# EAGLE design Arduino BNO080 (EAGLE 9.5.0)
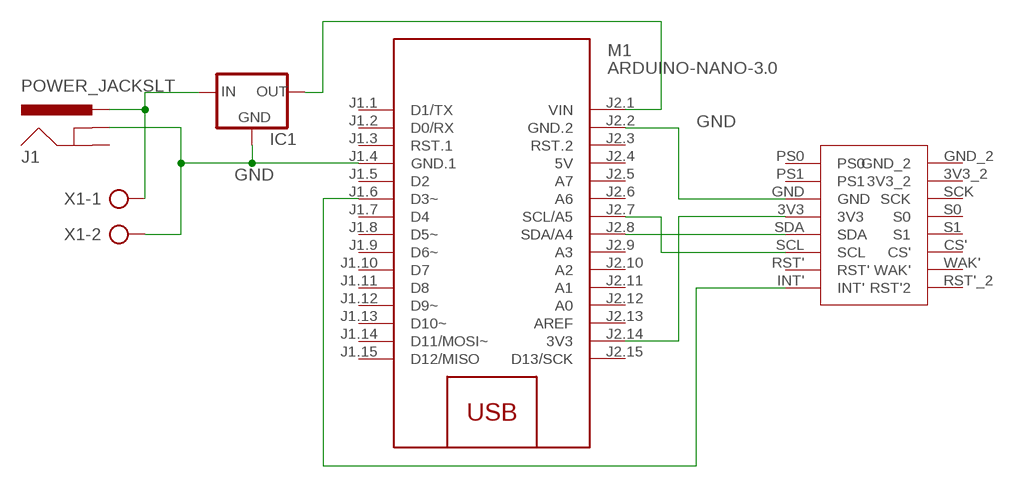
[diagram p0: schematic, sheet 1]

## Parts
IC1  78XXS  [78XXS]
J1  POWER_JACKSLT  [POWER_JACK_SLOT]
M1  ARDUINO-NANO-3.0  [ARDUINO-NANO-3.0]
U$1  BNO080  [BNO080]
X1  AK300/2  [AK300/2]

## Nets
GND: IC1.GND J1.GND@1(GNDBREAK) M1.J1.4(GND.1) M1.J2.2(GND.2) U$1.GND X1.2
N$1: M1.J2.8(SDA/A4) U$1.SDA
N$2: M1.J2.7(SCL/A5) U$1.SCL
N$3: M1.J2.14(3V3) U$1.3V3
N$5: M1.J1.6(D3~) U$1.INT'
N$7: IC1.IN J1.PWR X1.1
N$8: IC1.OUT M1.J2.1(VIN)
Unconnected: J1.GND@2(GND) M1.J1.1(D1/TX) M1.J1.2(D0/RX) M1.J1.3(RST.1) M1.J1.5(D2) M1.J1.7(D4) M1.J1.8(D5~) M1.J1.9(D6~) M1.J1.10(D7) M1.J1.11(D8) M1.J1.12(D9~) M1.J1.13(D10~) M1.J1.14(D11/MOSI~) M1.J1.15(D12/MISO) M1.J2.3(RST.2) M1.J2.5(A7) M1.J2.6(A6) M1.J2.9(A3) M1.J2.10(A2) M1.J2.11(A1) M1.J2.12(A0) M1.J2.13(AREF) M1.J2.15(D13/SCK) U$1.3V3_2 U$1.CS' U$1.GND_2 U$1.PS0 U$1.PS1 U$1.RST' U$1.RST'_2(RST'2) U$1.S0 U$1.S1 U$1.SCK U$1.WAK'

## Power pins joined to a net without a drawn wire
5V: M1.J2.4(5V)

## Library data of the parts
IC1 = v-reg:78XXS: VOLTAGE REGULATOR
J1 = SparkFun-Connectors:POWER_JACK: Power Jack Connector This is the standard 5.5mm barrel jack for power. The PTH is the most common, proven, reliable, footprint. The Slot footprint only works if the mill layer is transmitted to the PCB fab house so be warned. Here are the connectors we sell at SparkFun: DC Barrel Power Jack/Connector <https://www.sparkfun.com/products/119> (PRT-00119) DC Barrel Power Jack/Connector (SMD) <https://www.sparkfun.com/products/12748> (PRT-12748) DC Barrel Jack Adapter - Breadboard Compatible <https://www.sparkfun.com/products/10811> (PRT-10811) It is used on this SparkFun product (and many, many others): SparkFun RedBoard - Programmed with Arduino <https://www.sparkfun.com/products/12757> (DEV-12757) Also, if you need a mating power supply or connector, please check these out: Wall Adapter Power Supply - 9VDC 650mA <https://www.sparkfun.com/products/298> (TOL-00298) DC Barrel Jack Adapter - Male <https://www.sparkfun.com/products/10287> (PRT-10287); PROD_ID: PRT-00119
M1 = diy-modules:ARDUINO-NANO-3.0: Arduino Nano 3.0 and compatible devices More details available here: https://www.arduino.cc/en/Main/ArduinoBoardNano Click here to find device on ebay.com <http://www.ebay.com/sch/arduino+nano>
U$1 = BNO080:BNO080
X1 = con-ptr500:AK300/2: CONNECTOR; OC_FARNELL: unknown; OC_NEWARK: unknown

## Board
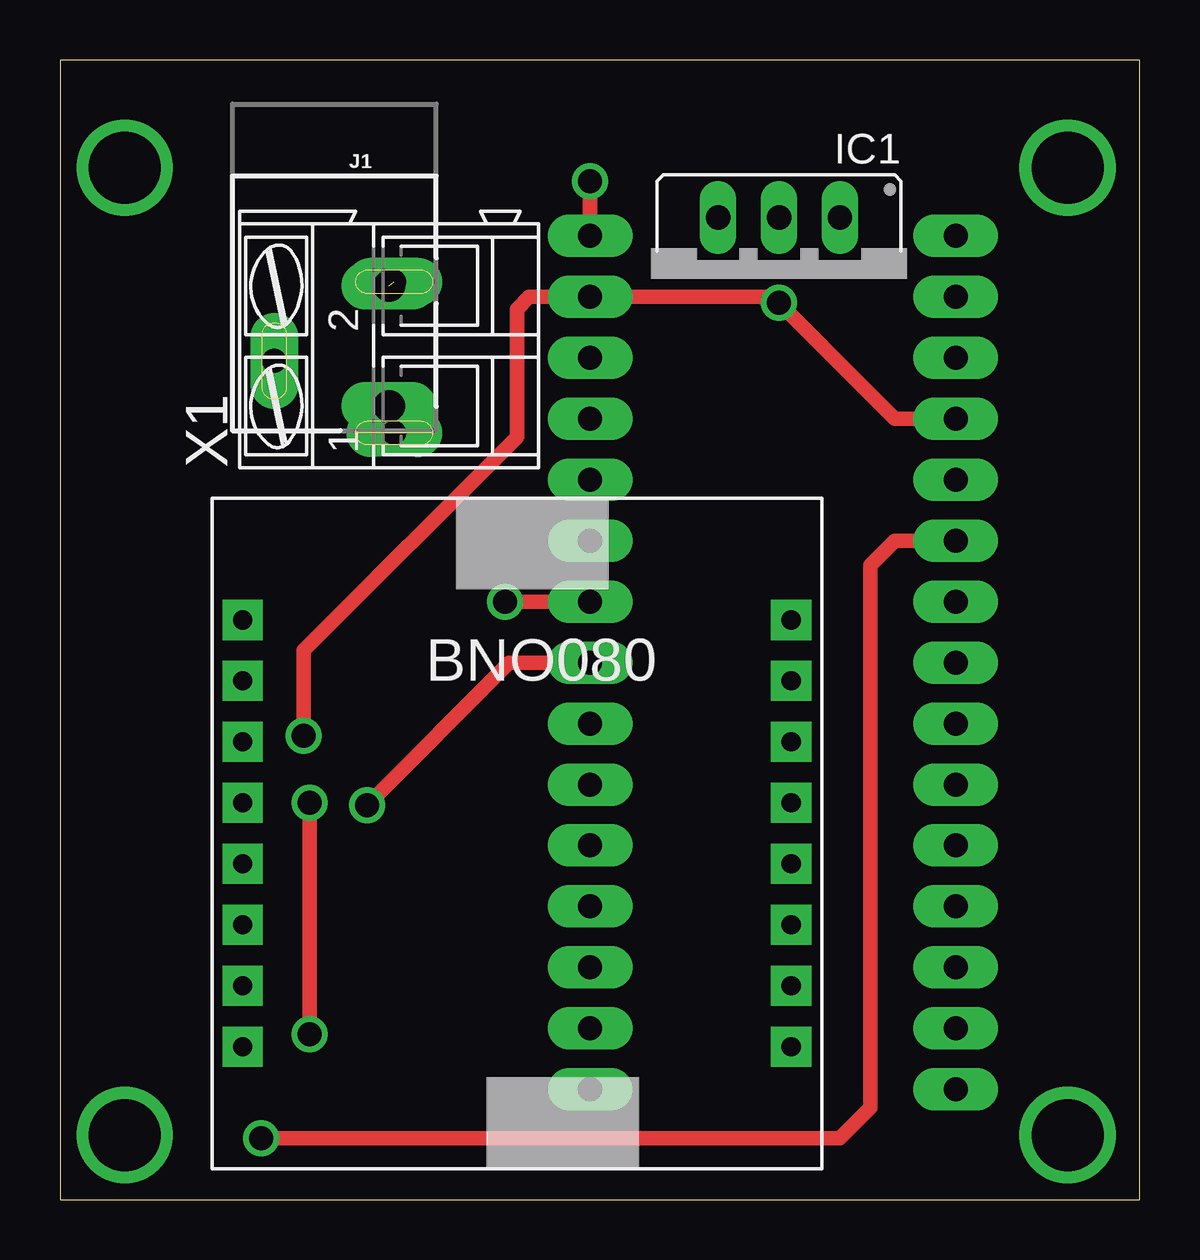
[diagram p1: board, top side]
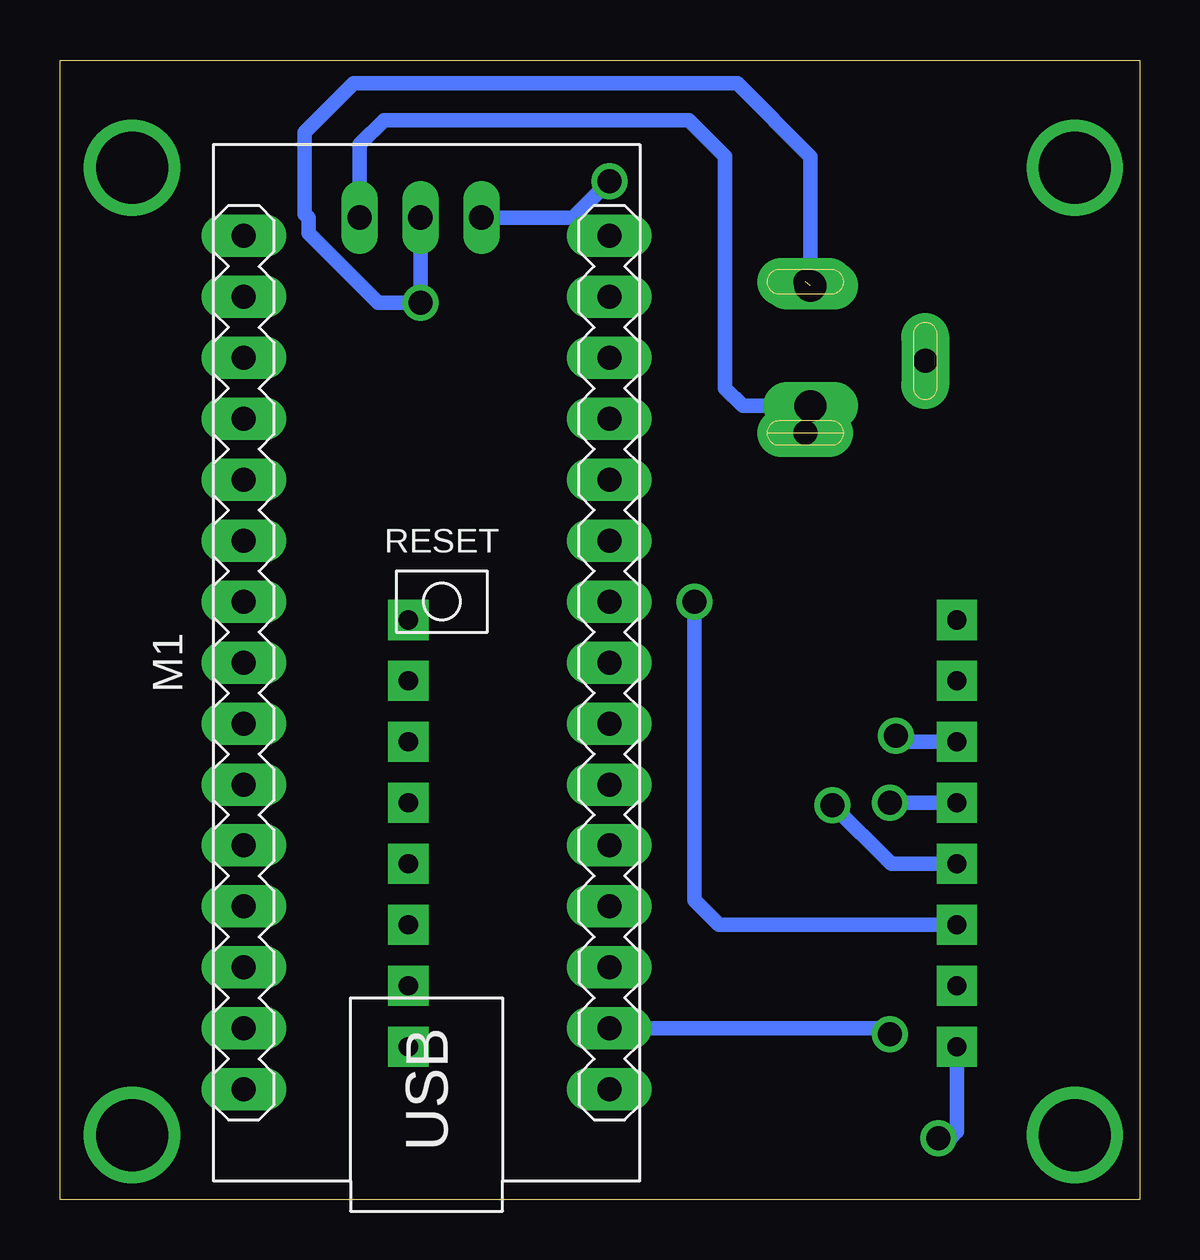
[diagram p2: board, bottom side, seen from below]

Size 45 x 47.49 mm. Coordinates in mm from the lower left corner, seen from the top.
Outline: 0,0 45,0 45,47.49 0,47.49 0,0
Copper layers (1*16): Top 0.035mm / dielectric 1.5mm / Bottom 0.035mm
Design rules "default": minimum track width 6mil, minimum drill 0.35mm, track to track 24mil, track to pad 24mil, pad to pad 24mil, via to via 24mil, smd to smd 24mil, copper to edge 40mil, drill to drill 6mil, minimum pad ring 10mil, minimum via ring 8mil, stop-mask expansion 4mil, vias tented up to drill 0mil, thermal gap 10mil

### Footprints (pad centres in the part's own frame; a part is rotated, then mirrored left to right if it is on the bottom)
78XXS = drill 1.016 long: GND 0,-2.54; IN -2.54,-2.54; OUT 2.54,-2.54
POWER_JACK_SLOT = drill 1 pad 2 long: GND@1 2.58,7.5; GND@2 7.58,10.8; PWR 2.58,13.8
ARDUINO-NANO-3.0 = drill 1 pad 1.778 long: J1.1 17.78,7.62; J1.2 15.24,7.62; J1.3 12.7,7.62; J1.4 10.16,7.62; J1.5 7.62,7.62; J1.6 5.08,7.62; J1.7 2.54,7.62; J1.8 0,7.62; J1.9 -2.54,7.62; J1.10 -5.08,7.62; J1.11 -7.62,7.62; J1.12 -10.16,7.62; J1.13 -12.7,7.62; J1.14 -15.24,7.62; J1.15 -17.78,7.62; J2.1 17.78,-7.62; J2.2 15.24,-7.62; J2.3 12.7,-7.62; J2.4 10.16,-7.62; J2.5 7.62,-7.62; J2.6 5.08,-7.62; J2.7 2.54,-7.62; J2.8 0,-7.62; J2.9 -2.54,-7.62; J2.10 -5.08,-7.62; J2.11 -7.62,-7.62; J2.12 -10.16,-7.62; J2.13 -12.7,-7.62; J2.14 -15.24,-7.62; J2.15 -17.78,-7.62
BNO080 = drill 0.8 pad 1.676 square: 3V3 -10.16,-6.35; 3V3_2 12.7,-1.27; CS' 12.7,-11.43; GND -10.16,-3.81; GND_2 12.7,1.27; INT' -10.16,-16.51; PS0 -10.16,1.27; PS1 -10.16,-1.27; RST' -10.16,-13.97; RST'_2 12.7,-16.51; S0 12.7,-6.35; S1 12.7,-8.89; SCK 12.7,-3.81; SCL -10.16,-11.43; SDA -10.16,-8.89; WAK' 12.7,-13.97
AK300/2 = drill 1.321 long: 1 -2.515,0; 2 2.489,0

### Placement (x,y rotation side)
IC1  29.97,38.39 180 top
J1  16.51,45.75 180 top
M1  29.72,22.38 90 bottom
U$1  17.78,22.89 0 top
X1  13.72,35.59 90 top

### Tracks (layer width: path | path; a pad name or v marks a point on that pad's centre or on a via)
GND  (via drill 1)  (1 unrouted)
  Top 0.61: v10.16,19.34 10.16,22.89 19.05,31.78 19.05,37.12 19.56,37.62 M1.J2.2 29.72,37.62 v29.97,37.37 34.8,32.54 M1.J1.4
  Bottom 0.61: v10.16,19.34 9.91,19.08 U$1.GND | IC1.GND v29.97,37.37 31.75,37.37 34.65,40.27 34.65,40.91 34.8,41.06 34.8,44.48 32.77,46.51 16.76,46.51 13.72,43.47 X1.2
N$1  (via drill 1)
  Top 0.61: M1.J2.8 18.73,22.38 v12.79,16.45
  Bottom 0.61: v12.79,16.45 10.35,14 U$1.SDA
N$2  (via drill 1)
  Top 0.61: M1.J2.7 v18.54,24.92
  Bottom 0.61: v18.54,24.92 18.54,12.48 17.53,11.46 U$1.SCL
N$3  (via drill 1)
  Top 0.61: v10.41,6.89 v10.41,16.54
  Bottom 0.61: M1.J2.14 10.67,7.14 v10.41,6.89 | v10.41,16.54 U$1.3V3
N$4  (via drill 3 pad 3.1)
  other vias: 2.7,43
N$5  (via drill 1)
  Top 0.61: M1.J1.6 34.8,27.46 33.78,26.45 33.78,3.84 32.51,2.57 v8.38,2.57
  Bottom 0.61: U$1.INT' 7.62,2.83 7.87,2.57 v8.38,2.57
N$6  (via drill 3 pad 3.1)
  other vias: 42,43
N$7
  Bottom 0.61: IC1.IN 32.51,43.97 31.5,44.99 18.78,44.99 17.27,43.48 17.27,33.81 16.54,33.08 X1.1 13.93,32.86 J1.PWR
N$8  (via drill 1)
  Top 0.61: M1.J2.1 v22.1,42.45
  Bottom 0.61: IC1.OUT 23.62,40.93 v22.1,42.45
N$9  (via drill 3 pad 3.1)
  other vias: 2.7,2.7
N$10  (via drill 3 pad 3.1)
  other vias: 42,2.7